# Altium schematic sheet P-MT3620RDB-1-6_WiFi.SchDoc: MT3620 RDB WiFi
size A3; CompanyName: Microsoft Research; DrawnBy: Stuart Taylor; Revision: 1.6; SheetNumber: 1; SheetTotal: 5; ProjectName: MT3620 Reference Development Board
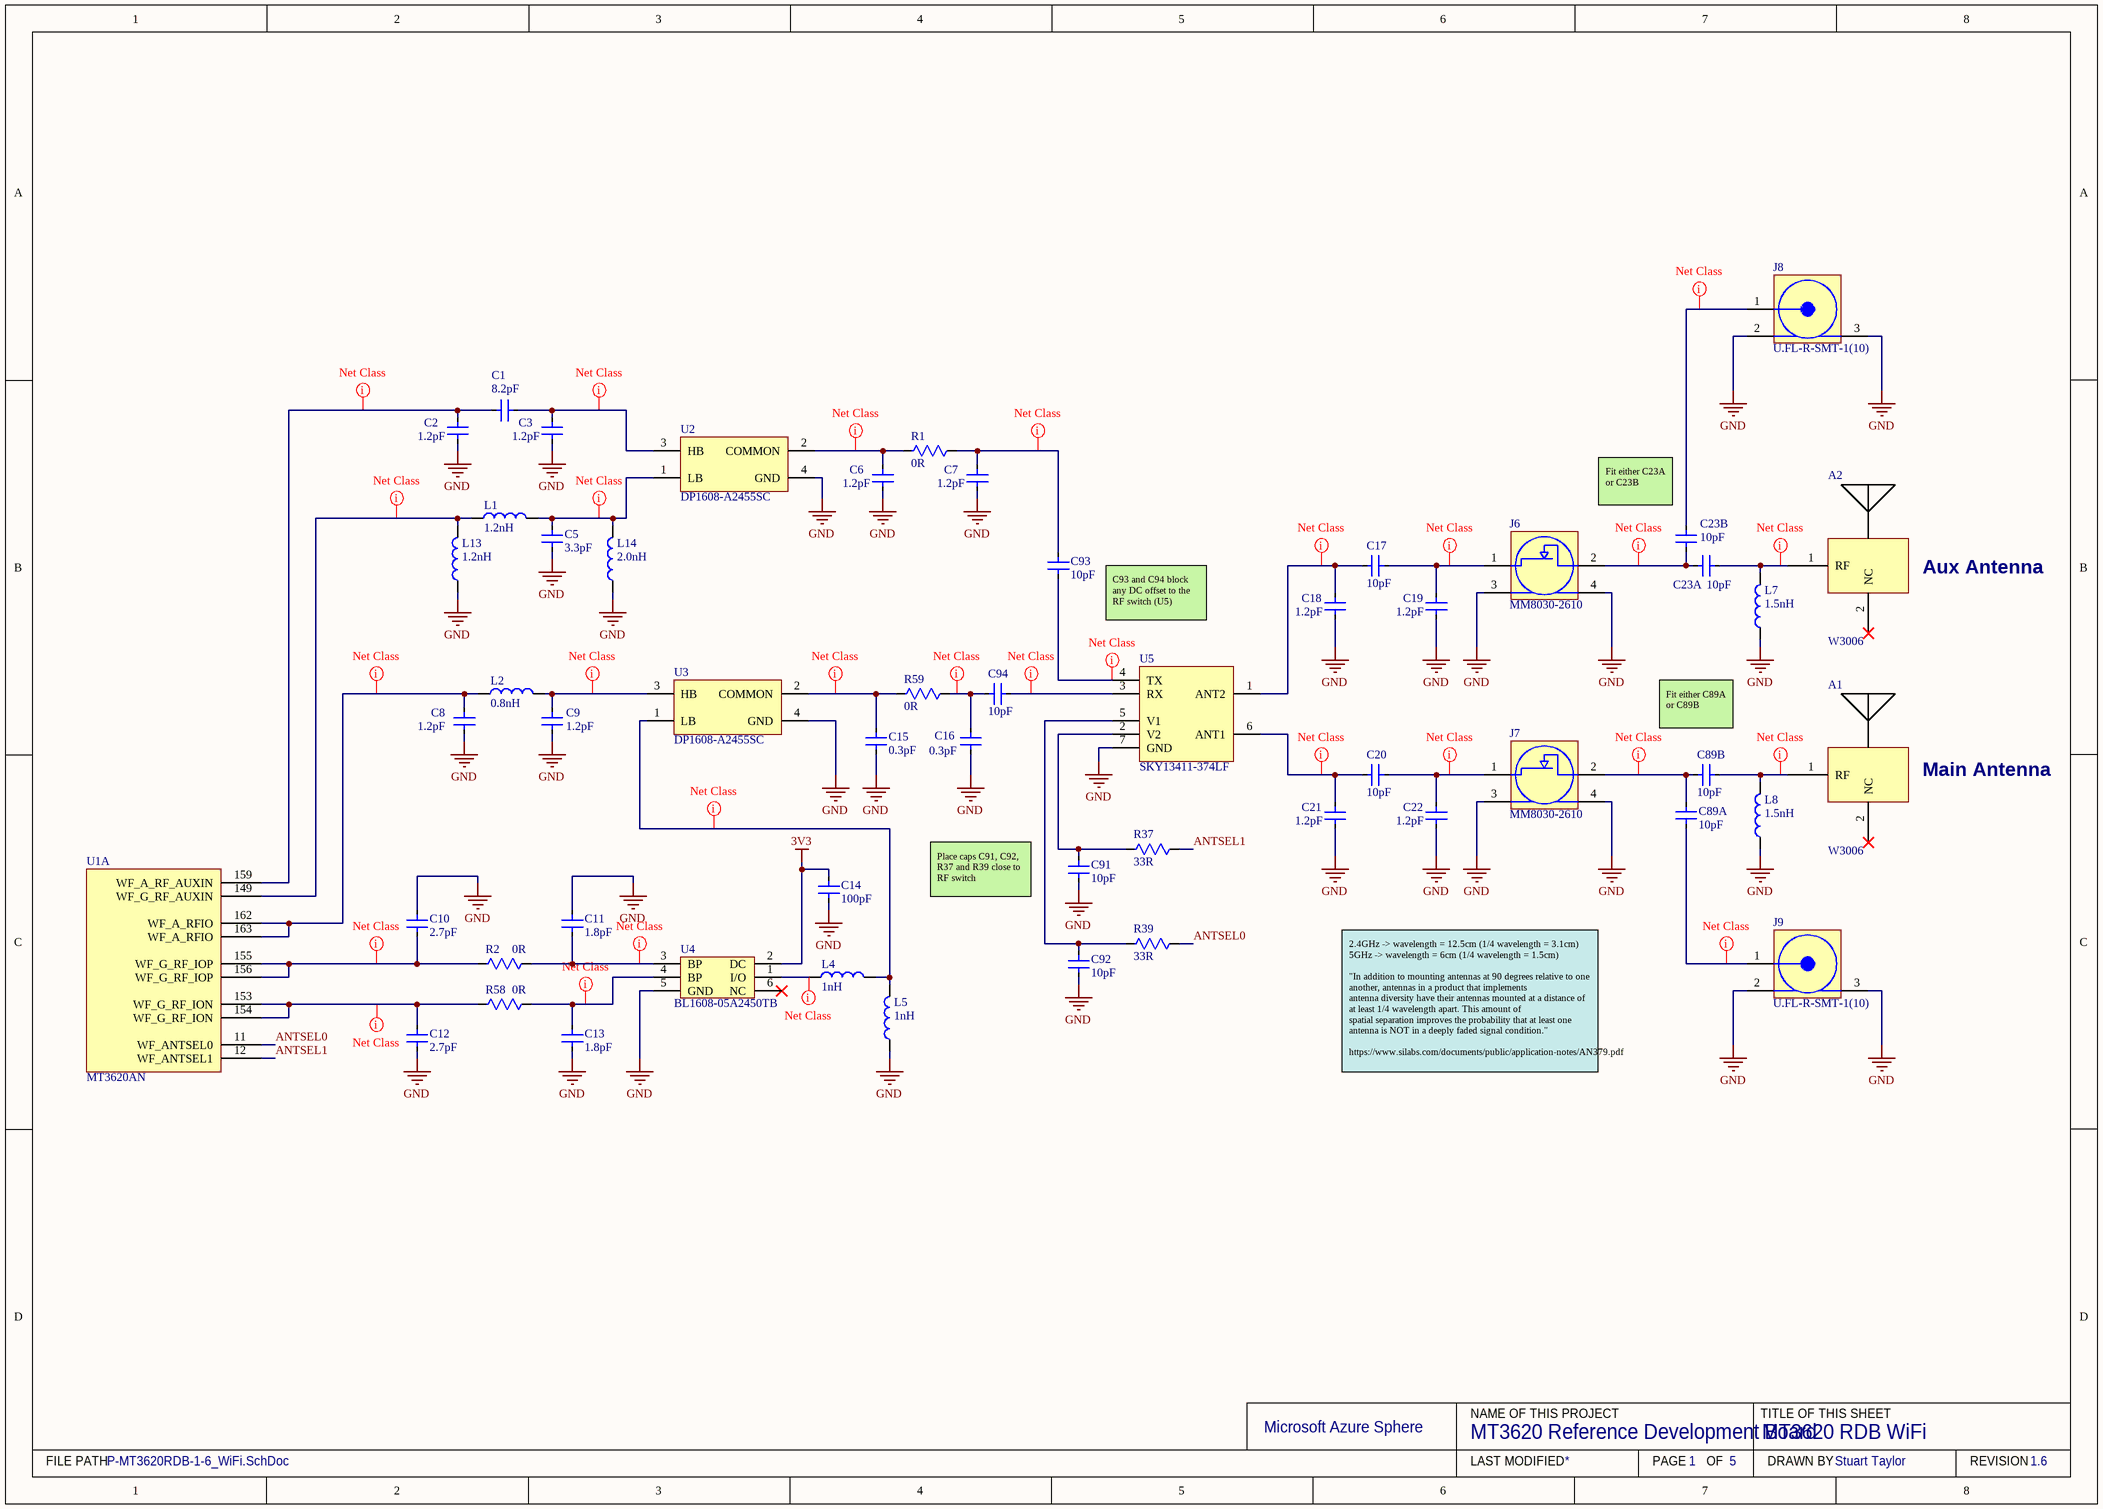
[diagram p0: P-MT3620RDB-1-6_WiFi.SchDoc]

## Parts
A1  W3006  [W3006]
A2  W3006  [W3006]
C1  8.2pF  [TDK 2010]
C2  1.2pF  [TDK 2010]
C3  1.2pF  [TDK 2010]
C5  3.3pF  [TDK 2010]
C6  1.2pF  [TDK 2010]
C7  1.2pF  [TDK 2010]
C8  1.2pF  [TDK 2010]
C9  1.2pF  [TDK 2010]
C10  2.7pF  [TDK 2010]
C11  1.8pF  [TDK 2010]
C12  2.7pF  [TDK 2010]
C13  1.8pF  [TDK 2010]
C14  100pF  [CAPC1005-EIA0402 0.55MM MED]
C15  0.3pF  [TDK 2010]
C16  0.3pF  [TDK 2010]
C17  10pF  [TDK 2010]
C18  1.2pF  [TDK 2010]
C19  1.2pF  [TDK 2010]
C20  10pF  [TDK 2010]
C21  1.2pF  [TDK 2010]
C22  1.2pF  [TDK 2010]
C23  10pF  [CAPC1005-EIA0402 0.55MM MED - THREE WAY]  (parts A,B of 2)
C89  10pF  [CAPC1005-EIA0402 0.55MM MED - THREE WAY]  (parts A,B of 2)
C91  10pF  [TDK 2010]
C92  10pF  [TDK 2010]
C93  10pF  [TDK 2010]
C94  10pF  [TDK 2010]
J6  MM8030-2610  [MM8030-2610]
J7  MM8030-2610  [MM8030-2610]
J8  U.FL-R-SMT-1(10)  [U.FL-R-SMT-1(10)]
J9  U.FL-R-SMT-1(10)  [U.FL-R-SMT-1(10)]
L1  1.2nH  [TDK 2010]
L2  0.8nH  [TDK 2010]
L4  1nH  [TDK 2010]
L5  1nH  [TDK 2010]
L7  1.5nH  [TDK 2010]
L8  1.5nH  [TDK 2010]
L13  1.2nH  [TDK 2010]
L14  2.0nH  [TDK 2010]
R1  0R  [TDK 2010]
R2  0R  [TDK 2010]
R37  33R  [RES 0402 MEDIUM DENSITY]
R39  33R  [RES 0402 MEDIUM DENSITY]
R58  0R  [TDK 2010]
R59  0R  [TDK 2010]
U1  MT3620AN  [MT3620_MaskSquaresVias50]  (part A of 14)
U2  DP1608-A2455SC  [DP1608-A2455SC]
U3  DP1608-A2455SC  [DP1608-A2455SC]
U4  BL1608-05A2450TB  [BL1608-05A2450TB]
U5  SKY13411-374LF  [SKY13411-374LF]

## Nets
3V3: C14.2 U4.2(DC)
GND: C2.1 C3.1 C5.1 C6.1 C7.1 C8.1 C9.1 C10.2 C11.2 C12.1 C13.1 C14.1 C15.1 C16.1 C18.1 C19.1 C21.1 C22.1 C91.1 C92.1 J6.3(GND) J6.4(GND) J7.3(GND) J7.4(GND) J8.2(GND) J8.3(GND) J9.2(GND) J9.3(GND) L5.1 L7.1 L8.1 L13.1 L14.1 U2.4(GND) U3.4(GND) U4.5(GND) U5.7(GND)
ANTSEL0: R39.1 U1.11(WF_ANTSEL0)
ANTSEL1: R37.1 U1.12(WF_ANTSEL1)
NetA1_1: A1.1(RF) C89.3 L8.2
NetA2_1: A2.1(RF) C23.2 L7.2
NetC1_1: C1.1 C2.2 U1.159(WF_A_RF_AUXIN)
NetC1_2: C1.2 C3.2 U2.3(HB)
NetC5_2: C5.2 L1.2 L14.2 U2.1(LB)
NetC6_2: C6.2 R1.2 U2.2(COMMON)
NetC7_2: C7.2 C93.2 R1.1
NetC8_2: C8.2 L2.1 U1.162(WF_A_RFIO) U1.163(WF_A_RFIO)
NetC9_2: C9.2 L2.2 U3.3(HB)
NetC10_1: C10.1 R2.2 U1.155(WF_G_RF_IOP) U1.156(WF_G_RF_IOP)
NetC11_1: C11.1 R2.1 U4.3(BP)
NetC12_2: C12.2 R58.2 U1.153(WF_G_RF_ION) U1.154(WF_G_RF_ION)
NetC13_2: C13.2 R58.1 U4.4(BP)
NetC15_2: C15.2 R59.2 U3.2(COMMON)
NetC16_2: C16.2 C94.2 R59.1
NetC17_1: C17.1 C18.2 U5.1(ANT2)
NetC17_2: C17.2 C19.2 J6.1(IN)
NetC20_1: C20.1 C21.2 U5.6(ANT1)
NetC20_2: C20.2 C22.2 J7.1(IN)
NetC23_1: C23.1 J6.2(OUT)
NetC23_3: C23.3 J8.1(IN)
NetC89_1: C89.1 J7.2(OUT)
NetC89_2: C89.2 J9.1(IN)
NetC91_2: C91.2 R37.2 U5.2(V2)
NetC92_2: C92.2 R39.2 U5.5(V1)
NetC93_1: C93.1 U5.4(TX)
NetC94_1: C94.1 U5.3(RX)
NetL1_1: L1.1 L13.2 U1.149(WF_G_RF_AUXIN)
NetL4_1: L4.1 U4.1(I/O)
NetL4_2: L4.2 L5.2 U3.1(LB)

Not connected (* = marked no-connect by the designer): A1 2(NC)*; A2 2(NC)*; U4 6(NC)*

## Layout directives
net class RF: NetA1_1, NetA2_1, NetC1_1, NetC1_2, NetC5_2, NetC6_2, NetC7_2, NetC8_2, NetC9_2, NetC15_2, NetC16_2, NetC17_1, NetC17_2, NetC20_1, NetC20_2, NetC23_1, NetC23_3, NetC89_1, NetC89_2, NetC93_1, NetC94_1, NetL1_1, NetL4_1, NetL4_2
net class RFD: NetC10_1, NetC11_1, NetC12_2, NetC13_2

## Notes on the sheet
- (near C23) Fit either C23A or C23B
- Aux Antenna
- C93 and C94 block any DC offset to the RF switch (U5)
- Fit either C89A or C89B
- Main Antenna
- (near C91) Place caps C91, C92, R37 and R39 close to RF switch
- 2.4GHz -> wavelength = 12.5cm (1/4 wavelength = 3.1cm)
  5GHz -> wavelength = 6cm (1/4 wavelength = 1.5cm)
  "In addition to mounting antennas at 90 degrees relative to one another, antennas in a product that implements
  antenna diversity have their antennas mounted at a distance of at least 1/4 wavelength apart. This amount of
  spatial separation improves the probability that at least one antenna is NOT in a deeply faded signal condition."
  https://www.silabs.com/documents/public/application-notes/AN379.pdf
- Microsoft Azure Sphere
- NAME OF THIS PROJECT
- TITLE OF THIS SHEET
- FILE PATH
- LAST MODIFIED
- PAGE
- OF
- DRAWN BY
- REVISION

## Library data of the parts
A1 A2 = W3006: W3006 Chip Antenna; Manufacturer: Pulse Electronics Corporation; Frequency Group: UHF (2 GHz ~ 3 GHz), SHF (f > 4 GHz); Frequency (Center/Band): 2.4GHz, 5.5GHz; Frequency Range: 2.4GHz ~ 2.483GHz, 5.15GHz ~ 5.85GHz; Number of Bands: 2; Return Loss: -8dB, -10dB; Gain: 3.2dBi, 4.2dBi; NoThermalRelief: ture; Supplier 1: Digi-Key; Supplier Part Number 1: 553-1673-2-ND; Manufacturer Part Number: W3006; RoHS: RoHS Compliant; Category: RF/IF and RFID; Stock 1: 2000; Pricing 1: 1000=0.72505, 2000=0.67505, 5000=0.65004, 10000=0.62504 (GBP); Packaging: Tape & Reel (TR); Part Status: Active; Antenna Type: Chip; VSWR: -; Power - Max: -; Features: -; Termination: Solder; Ingress Protection: -; Mounting Type: Surface Mount; Height (Max): 0.059" (1.50mm); Applications: WLAN, Zigbee™; ComponentLink1URL: http://productfinder.pulseeng.com/products/datasheets/W3006.pdf; ComponentLink1Description: http://productfinder.pulseeng.com/products/datasheets/W3006.pdf
C1 = GJM0335C1E8R2CB01D: CAP CER 8.2PF 25V NP0 0201; Manufacturer: Murata; Dielectric: C0G; Supplier 1: Digi-Key; Manufacturer Part Number: GJM0335C1E8R2CB01D; Stock 1: 3138; Pricing 1: 1=0.1, 10=0.043, 100=0.0192, 500=0.0137, 1000=0.0108, 2500=0.0098, 5000=0.009 (USD); Mount: Surface Mount; Case/Package: 0201; Weight: 1.2E-05oz; Case Code (Imperial): 0201; Case Code (Metric): 0603; Min Operating Temperature: -55°C; Max Operating Temperature: 125°C; Capacitance: 8.2pF; Voltage Rating (DC): 25V; Packaging: Tape and Reel; Voltage Rating: 25V; Termination: SMD/SMT; Package Quantity: 15000; Length: 0.024inch; Height: 0.3mm; Width: 0.3mm; Thickness: 0.013inch; ComponentLink1URL: http://www.mouser.com/ds/2/281/Murata GJM Series-1186094.pdf; ComponentLink1Description: http://www.mouser.com/ds/2/281/Murata GJM Series-1186094.pdf; Supplier Part Number 1: 490-14540-1-ND
C2 C3 C6-C9 C18 C19 C21 C22 = 1.2pF 0201 25V: CAP CER 1.2PF 25V C0G 0201; Manufacturer: TDK Corporation; Manufacturer Part Number: C0603C0G1E1R2B; Tolerance: ±0.1pF; Temperature Coefficient: C0G, NP0; NoThermalRelief: true; Supplier 1: Digi-Key; RoHS: RoHS Compliant; Category: Capacitors; Stock 1: 891; Pricing 1: 1=0.07, 10=0.022, 100=0.0101, 250=0.00828, 500=0.00708, 1000=0.00552, 5000=0.0046 (GBP); Packaging: Cut Tape (CT); Capacitance: 1.2pF; Voltage - Rated: 25V; Mounting Type: Surface Mount, MLCC; Operating Temperature: -55°C ~ 125°C; Applications: General Purpose; Ratings: -; Package / Case: 0201 (0603 Metric); Size / Dimension: 0.024" L x 0.012" W (0.60mm x 0.30mm); Height - Seated (Max): -; Thickness (Max): 0.013" (0.33mm); Lead Spacing: -; Features: -; Lead Style: -; ComponentLink1URL: http://media.digikey.com/pdf/Data%20Sheets/TDK%20PDFs/C_Series_GeneralAppl_B11.pdf; ComponentLink1Description: http://media.digikey.com/pdf/Data%20Sheets/TDK%20PDFs/C_Series_GeneralAppl_B11.pdf; Supplier Part Number 1: 445-4594-1-ND
C5 = 3.3pF 0201 25V: Cap Ceramic 3.3pF 25V C0G 0.25pF SMD 0201 125C T/R; Manufacturer: TDK; Manufacturer Part Number: CGA1A2C0G1E3R3C030BA; NoThermalRelief: true; Supplier 1: Digi-Key; Stock 1: 1636; Pricing 1: 1=0.12, 10=0.088, 100=0.0413, 500=0.029, 1000=0.024, 2500=0.0223, 5000=0.0204 (USD); Mount: Surface Mount; Case/Package: 0201; Weight: 6E-06oz; Case Code (Metric): 0603; Case Code (Imperial): 0201; Min Operating Temperature: -55°C; Max Operating Temperature: 125°C; Packaging: Tape and Reel; Package Quantity: 1; Capacitance: 3.3pF; Voltage Rating: 25V; Voltage Rating (DC): 25V; Dielectric: C0G; Termination: SMD/SMT; Composition: Ceramic; Length: 0.6mm; Height: 0.3mm; Width: 0.012inch; Thickness: 0.013inch; Depth: 0.3mm; ComponentLink1URL: https://datasheet.ciiva.com/24220/cga1a2c0g1e3r3c030ba-272998-24220339.pdf; ComponentLink1Description: https://datasheet.ciiva.com/24220/cga1a2c0g1e3r3c030ba-272998-24220339.pdf; Supplier Part Number 1: 445-9045-6-ND
C10 C12 = 2.7pF 0201 25V: CAP CER 2.7PF 25V C0G 0201; Manufacturer: TDK; Manufacturer Part Number: C0603C0G1E2R7B; Catalog Drawings: C SERIES_0201; Tolerance: ±0.1pF; Temperature Coefficient: C0G, NP0; Kits: SAMPLE KIT 1009-ND  - KIT CAP CER RF .2PF-10PF 445-9011-KIT-ND  - KIT CAP CER RF .2PF-10PF SMD; Other Names: 445-4610-1; NoThermalRelief: true; Supplier 1: Digikey; Stock 1: 16566; Pricing 1: 1=0.1, 10=0.038, 100=0.0168, 500=0.012, 1000=0.0094, 2500=0.0086, 5000=0.0079 (USD); Standard Package: 1; Category: Capacitors; Family: Ceramic Capacitors; Series: C; Packaging: Cut Tape (CT); Capacitance: 2.7pF; Voltage - Rated: 25V; Mounting Type: Surface Mount, MLCC; Operating Temperature: -55°C ~ 125°C; Applications: General Purpose; Ratings: -; Package / Case: 0201 (0603 Metric); Size / Dimension: 0.024" L x 0.012" W (0.60mm x 0.30mm); Height - Seated (Max): -; Thickness (Max): 0.013" (0.33mm); Lead Spacing: -; Features: -; Lead Style: -; ComponentLink1URL: https://datasheet.ciiva.com/26869/getdatasheetpartid-496273-26869685.pdf; ComponentLink1Description: https://datasheet.ciiva.com/26869/getdatasheetpartid-496273-26869685.pdf; ComponentLink2URL: https://datasheet.ciiva.com/5410/general-b11-5410742.pdf; ComponentLink2Description: https://datasheet.ciiva.com/5410/general-b11-5410742.pdf; ComponentLink3URL: https://datasheet.ciiva.com/130/c-series-generalappl-b11-130943.pdf; ComponentLink3Description: https://datasheet.ciiva.com/130/c-series-generalappl-b11-130943.pdf; ComponentLink4URL: https://datasheet.ciiva.com/130/c-series-generalappl-b11-130945.pdf; ComponentLink4Description: https://datasheet.ciiva.com/130/c-series-generalappl-b11-130945.pdf; ComponentLink5URL: https://datasheet.ciiva.com/130/c-series-generalappl-b11-130944.pdf; ComponentLink5Description: https://datasheet.ciiva.com/130/c-series-generalappl-b11-130944.pdf; Supplier Part Number 1: 445-4610-1-ND
C11 C13 = GJM0335C1E1R8CB01D: CAP CER 1.8PF 25V NP0 0201; Manufacturer: Murata; Dielectric: C0G; Supplier 1: Digi-Key; Manufacturer Part Number: GJM0335C1E1R8CB01D; Stock 1: 87034; Pricing 1: 1=0.1, 10=0.043, 100=0.0192, 500=0.0137, 1000=0.0108, 2500=0.0098, 5000=0.009 (USD); Mount: Surface Mount; Case/Package: 0201; Case Code (Imperial): 0201; Case Code (Metric): 0603; Min Operating Temperature: -55°C; Max Operating Temperature: 125°C; Capacitance: 1.8pF; Package Quantity: 1; Packaging: Tape and Reel; Voltage Rating: 25V; Termination: SMD/SMT; Voltage Rating (DC): 25V; Length: 0.6mm; Height: 0.3mm; Width: 0.012inch; Thickness: 0.013inch; Depth: 0.3mm; Radiation Hardening: No; Lead Free: Lead Free; ComponentLink1URL: https://datasheet.ciiva.com/11615/product-11615586.pdf; ComponentLink1Description: https://datasheet.ciiva.com/11615/product-11615586.pdf; ComponentLink2URL: https://datasheet.ciiva.com/133/partnumbering-e-01-133454.pdf; ComponentLink2Description: https://datasheet.ciiva.com/133/partnumbering-e-01-133454.pdf; ComponentLink3URL: https://datasheet.ciiva.com/133/partnumbering-e-01-133455.pdf; ComponentLink3Description: https://datasheet.ciiva.com/133/partnumbering-e-01-133455.pdf; ComponentLink4URL: https://datasheet.ciiva.com/17453/product-17453450.pdf; ComponentLink4Description: https://datasheet.ciiva.com/17453/product-17453450.pdf; ComponentLink5URL: https://datasheet.ciiva.com/133/partnumbering-e-01-133453.pdf; ComponentLink5Description: https://datasheet.ciiva.com/133/partnumbering-e-01-133453.pdf; Supplier Part Number 1: 490-3059-1-ND
C14 = 100pF 0402 C0G, NP0 50V: CAP CER 100PF 50V 5% NP0 0402; Manufacturer: TDK Corporation; Manufacturer Part Number: C1005C0G1H101J050BA; NoThermalRelief: true; Supplier 1: Digi-Key; RoHS: RoHS Compliant; Category: Capacitors; Stock 1: 47833; Pricing 1: 0.00233; Packaging: Tape & Reel (TR); Tolerance: ±5%; Voltage - Rated: 50V; Temperature Coefficient: C0G, NP0; Mounting Type: Surface Mount, MLCC; Operating Temperature: -55°C ~ 125°C; Applications: General Purpose; Package / Case: 0402 (1005 Metric); Size / Dimension: 0.039" L x 0.020" W (1.00mm x 0.50mm); Height - Seated (Max): -; Thickness (Max): 0.022" (0.55mm); Lead Spacing: -; Features: -; Lead Style: -; ComponentLink1URL: http://product.tdk.com/en/catalog/datasheets/mlcc_commercial_general_en.pdf; ComponentLink1Description: http://product.tdk.com/en/catalog/datasheets/mlcc_commercial_general_en.pdf; Supplier Part Number 1: 445-1247-2-ND; Ratings: -; Capacitance: 100pF
C15 C16 = 0.3pF 0201 25V: CAP CER 0.3PF 25V C0G 0201; Manufacturer: TDK Corporation; Manufacturer Part Number: C0603C0G1E0R3B; Capacitance: 0.30pF; Tolerance: ±0.1pF; Temperature Coefficient: C0G, NP0; NoThermalRelief: true; Supplier 1: Digi-Key; RoHS: RoHS Compliant; Category: Capacitors; Stock 1: 19260; Pricing 1: 1=0.07, 10=0.03, 100=0.0139, 250=0.01132, 500=0.0097, 1000=0.00756, 5000=0.0063 (GBP); Packaging: Cut Tape (CT); Voltage - Rated: 25V; Mounting Type: Surface Mount, MLCC; Operating Temperature: -55°C ~ 125°C; Applications: General Purpose; Ratings: -; Package / Case: 0201 (0603 Metric); Size / Dimension: 0.024" L x 0.012" W (0.60mm x 0.30mm); Height - Seated (Max): -; Thickness (Max): 0.013" (0.33mm); Lead Spacing: -; Features: -; Lead Style: -; ComponentLink1URL: http://media.digikey.com/pdf/Data%20Sheets/TDK%20PDFs/C_Series_GeneralAppl_B11.pdf; ComponentLink1Description: http://media.digikey.com/pdf/Data%20Sheets/TDK%20PDFs/C_Series_GeneralAppl_B11.pdf; Supplier Part Number 1: 445-7205-1-ND
C17 C20 C91-C94 = 10pF 0201 25V: CAP CER 10PF 25V C0G 0201; Manufacturer: TDK Corporation; Manufacturer Part Number: C0603C0G1E100D030BA; Tolerance: ±0.5pF; Temperature Coefficient: C0G, NP0; NoThermalRelief: true; Supplier 1: Digi-Key; RoHS: RoHS Compliant; Category: Capacitors; Stock 1: 331754; Pricing 1: 1=0.07, 10=0.03, 100=0.0139, 250=0.01132, 500=0.0097, 1000=0.00756, 5000=0.0063 (GBP); Packaging: Digi-Reel®; Capacitance: 10pF; Voltage - Rated: 25V; Mounting Type: Surface Mount, MLCC; Operating Temperature: -55°C ~ 125°C; Applications: General Purpose; Ratings: -; Package / Case: 0201 (0603 Metric); Size / Dimension: 0.024" L x 0.012" W (0.60mm x 0.30mm); Height - Seated (Max): -; Thickness (Max): 0.013" (0.33mm); Lead Spacing: -; Features: Low ESL; Lead Style: -; ComponentLink1URL: https://product.tdk.com/info/en/catalog/datasheets/mlcc_commercial_general_en.pdf; ComponentLink1Description: https://product.tdk.com/info/en/catalog/datasheets/mlcc_commercial_general_en.pdf; Supplier Part Number 1: 445-4651-6-ND
C23 C89 = 10pF 0402 C0G, NP0 50V_1: CAP CER 10PF 50V NP0 0402 - Three-way pads; Manufacturer: TDK Corporation; Manufacturer Part Number: C1005C0G1H100D050BA; Tolerance: ±0.5pF; NoThermalRelief: true; Supplier 1: Digi-Key; RoHS: RoHS Compliant; Category: Capacitors; Stock 1: 47833; Pricing 1: 0.00274; Packaging: Tape & Reel (TR); Voltage - Rated: 50V; Temperature Coefficient: C0G, NP0; Mounting Type: Surface Mount, MLCC; Operating Temperature: -55°C ~ 125°C; Applications: General Purpose; Package / Case: 0402 (1005 Metric); Size / Dimension: 0.039" L x 0.020" W (1.00mm x 0.50mm); Height - Seated (Max): -; Thickness (Max): 0.022" (0.55mm); Lead Spacing: -; Features: -; Lead Style: -; ComponentLink1URL: http://product.tdk.com/en/catalog/datasheets/mlcc_commercial_general_en.pdf; ComponentLink1Description: http://product.tdk.com/en/catalog/datasheets/mlcc_commercial_general_en.pdf; Supplier Part Number 1: 445-1235-2-ND; Ratings: -; Capacitance: 10pF
J6 J7 = MM8030-2610: CONN UMC RECEPT SMD 2x2mm; Manufacturer: Murata Electronics North America; Manufacturer Part Number: MM8030-2610RK0; Connector Style: Ultra Miniature Coaxial; Connector Type: Receptacle, Female Socket; Contact Termination: Solder; Impedance: 50 Ohm; Frequency - Max: 11GHz; Center Contact Plating: Gold; Voltage Rating: 30V; NoThermalRelief: true; Supplier 1: Digi-Key; RoHS: RoHS Compliant; Category: Connectors, Interconnects; Stock 1: 11893; Pricing 1: 1=0.34, 10=0.325, 25=0.2788, 50=0.2368, 100=0.2276, 250=0.2044, 500=0.1951, 1000=0.16258, 2500=0.14864 (GBP); Packaging: Cut Tape (CT); Shield Termination: Solder; Mounting Type: Surface Mount; Cable Group: -; Fastening Type: Snap-On; Features: Internal Switch; Housing Color: -; Ingress Protection: -; Body Material: -; Body Finish: -; Center Contact Material: -; Dielectric Material: -; Operating Temperature: -40°C ~ 85°C; ComponentLink1URL: http://www.murata.com/~/media/webrenewal/support/library/catalog/products/switch/switch/o33e.ashx; ComponentLink1Description: http://www.murata.com/~/media/webrenewal/support/library/catalog/products/switch/switch/o33e.ashx; Supplier Part Number 1: 490-11804-1-ND
J8 J9 = U.FL-R-SMT-1(10): CONN UMC JACK STR 50 OHM SMD; Manufacturer: Hirose Electric (HRS); Featured Product: U.FL Series Connectors; Connector Style: U.FL, Ultra Miniature Coaxial; Connector Type: Receptacle, Male Pin; Contact Termination: Solder; Impedance: 50 Ohm; Frequency - Max: 6GHz; Body Material: Phosphor Bronze; Body Finish: Silver; Center Contact Material: Brass; Center Contact Plating: Gold; Dielectric Material: Liquid Crystal Polymer (LCP); Online Catalog: UMCC (Ultra Miniature Coax Connectors), U.FL Series; Other Names: H11891TR  Q5400621  U.FL-R-SMT-1 10  U.FL-R-SMT-1(10)-ND  UFLRSMT110; NoThermalRelief: true; Supplier 1: Farnell; Manufacturer Part Number: U.FL-R-SMT-1(10); Stock 1: 11130; Pricing 1: 1=0.84, 10=0.77 (GBP); Standard Package: 2,500; Category: Connectors, Interconnects; Family: Coaxial Connectors (RF); Series: U.FL; Packaging: Tape & Reel (TR); Shield Termination: Solder; Mounting Type: Surface Mount; Cable Group: -; Fastening Type: Snap-On; Features: -; Housing Color: Beige; Ingress Protection: -; Voltage Rating: -; Operating Temperature: -40°C ~ 90°C; ComponentLink1URL: https://datasheet.ciiva.com/11762/0900766b8105243f-11762474.pdf; ComponentLink1Description: https://datasheet.ciiva.com/11762/0900766b8105243f-11762474.pdf; ComponentLink2URL: https://datasheet.ciiva.com/7651/91524-7651915.pdf; ComponentLink2Description: https://datasheet.ciiva.com/7651/91524-7651915.pdf; ComponentLink3URL: https://datasheet.ciiva.com/7651/91524-7651914.pdf; ComponentLink3Description: https://datasheet.ciiva.com/7651/91524-7651914.pdf; Supplier Part Number 1: 1688077RL
L1 L13 = 1.2nH 0201: FIXED IND 1.2NH 1A 80 MOHM SMD; Manufacturer: TDK; Manufacturer Part Number: MHQ0603P1N2CT000; Core Material: Non-Magnetic; Shielding: Unshielded; DC Resistance (DCR): 80mR; Self Resonant Frequency: 10GHz; Test Frequency: 500MHz; NoThermalRelief: true; Supplier 1: Digi-Key; Stock 1: 13400; Pricing 1: 1=0.51, 10=0.443, 100=0.3163, 500=0.2657, 1000=0.2151, 2500=0.2024 (USD); Mount: Surface Mount; Case/Package: 0201; Case Code (Metric): 0603; Case Code (Imperial): 0201; Min Operating Temperature: -55°C; Max Operating Temperature: 125°C; Package Quantity: 15000; Packaging: Tape and Reel; Current Rating: 1A; Inductance: 1.2nh; Length: 0.026inch; Width: 0.014inch; Height - Seated (Max): 0.016inch; ComponentLink1URL: http://product.tdk.com/inductor/ind/en/documents/inductor_commercial_high-frequency_mhq_en.pdf; ComponentLink1Description: http://product.tdk.com/inductor/ind/en/documents/inductor_commercial_high-frequency_mhq_en.pdf; Supplier Part Number 1: 445-16782-6-ND
L2 = 0.8nH 0201: FIXED IND 0.8NH 1A 70 MOHM SMD; Manufacturer: TDK Corporation; Manufacturer Part Number: MHQ0603P0N8CT000; Type: Multilayer; Material - Core: Non-Magnetic; Tolerance: ±0.2nH; Shielding: Unshielded; DC Resistance (DCR): 70 mOhm Max; Frequency - Self Resonant: 10GHz; Frequency - Test: 500MHz; Supplier 1: Digi-Key; RoHS: RoHS Compliant; Category: Inductors, Coils, Chokes; Stock 1: 28900; Pricing 1: 1=0.31, 10=0.272, 50=0.2214, 100=0.2043, 500=0.17708, 1000=0.14984 (GBP); Packaging: Cut Tape (CT); Inductance: 0.8nH; Current Rating: 1A; Current - Saturation: -; Q @ Freq: -; Ratings: -; Operating Temperature: -55°C ~ 125°C; Mounting Type: Surface Mount; Package / Case: 0201 (0603 Metric); Size / Dimension: 0.026" L x 0.014" W (0.65mm x 0.35mm); Height - Seated (Max): 0.016" (0.40mm); ComponentLink1URL: https://product.tdk.com/info/en/catalog/datasheets/inductor_commercial_high-frequency_mhq0603p_en.pdf; ComponentLink1Description: https://product.tdk.com/info/en/catalog/datasheets/inductor_commercial_high-frequency_mhq0603p_en.pdf; Supplier Part Number 1: 445-16758-1-ND
L4 L5 = 1nH 0201: FIXED IND 1NH 1A 70 MOHM SMD; Manufacturer: TDK Corporation; Manufacturer Part Number: MHQ0603P1N0CT000; Type: Multilayer; Material - Core: Non-Magnetic; Tolerance: ±0.2nH; Shielding: Unshielded; DC Resistance (DCR): 70 mOhm Max; Frequency - Self Resonant: 10GHz; Frequency - Test: 500MHz; NoThermalRelief: true; Supplier 1: Digi-Key; RoHS: RoHS Compliant; Category: Inductors, Coils, Chokes; Stock 1: 28900; Pricing 1: 1=0.34, 10=0.3, 50=0.2436, 100=0.2248, 500=0.1948, 1000=0.16483 (GBP); Packaging: Cut Tape (CT); Inductance: 1nH; Current Rating: 1A; Current - Saturation: -; Q @ Freq: -; Ratings: -; Operating Temperature: -55°C ~ 125°C; Mounting Type: Surface Mount; Package / Case: 0201 (0603 Metric); Size / Dimension: 0.026" L x 0.014" W (0.65mm x 0.35mm); Height - Seated (Max): 0.016" (0.40mm); ComponentLink1URL: https://product.tdk.com/info/en/catalog/datasheets/inductor_commercial_high-frequency_mhq0603p_en.pdf; ComponentLink1Description: https://product.tdk.com/info/en/catalog/datasheets/inductor_commercial_high-frequency_mhq0603p_en.pdf; Supplier Part Number 1: 445-16776-1-ND
L7 L8 = LQP03TN1N5B02D: MURATA - LQP03TN1N5B02D - INDUCTOR, 1.5NH, 0.6A, 0.1NH, 15GHZ; Product Range: LQP03; Inductance: 1.5; DC Current Rating: 600; High Frequency Inductor Case: 0201 [0603 Metric]; Inductor Construction: Thin Film; DC Resistance Max: 0.15; Inductance Tolerance: ± 0.1; Self Resonant Frequency Min: 15; SVHC: No SVHC (17-Dec-2015; NoThermalRelief: true; Supplier 1: Farnell; Manufacturer: MURATA; Manufacturer Part Number: LQP03TN1N5B02D; RoHS: YES; Stock 1: 2224; Pricing 1: 10=0.0488, 100=0.037, 500=0.0284, 2500=0.023, 7500=0.021, 15000=0.0179, 75000=0.0163, 150000=0.016 (GBP); Packaging: Cut Tape; ComponentLink1URL: http://www.farnell.com/datasheets/1888754.pdf; ComponentLink1Description: http://www.farnell.com/datasheets/1888754.pdf; Supplier Part Number 1: 2470348RL
L14 = 2.0nH 0201: FIXED IND 2NH 700MA 120 MOHM SMD; Manufacturer: TDK; Manufacturer Part Number: MHQ0603P2N0CT000; Core Material: Non-Magnetic; Shielding: Unshielded; DC Resistance (DCR): 120mR; Self Resonant Frequency: 10GHz; Test Frequency: 500MHz; NoThermalRelief: true; Supplier 1: Digi-Key; Stock 1: 13400; Pricing 1: 1=0.51, 10=0.443, 100=0.3163, 500=0.2657, 1000=0.2151, 2500=0.2024 (USD); Mount: Surface Mount; Case/Package: 0201; Case Code (Metric): 0603; Case Code (Imperial): 0201; Min Operating Temperature: -55°C; Max Operating Temperature: 125°C; Package Quantity: 15000; Packaging: Cut Tape; Current Rating: 700mA; Inductance: 2nh; Length: 0.026inch; Width: 0.014inch; Height - Seated (Max): 0.016inch; ComponentLink1URL: https://datasheet.ciiva.com/41830/inductor-commercial-high-frequency-mhq-en-41830309.pdf; ComponentLink1Description: https://datasheet.ciiva.com/41830/inductor-commercial-high-frequency-mhq-en-41830309.pdf; Supplier Part Number 1: 445-16814-1-ND
R1 R2 R58 R59 = 0R 0201: RES SMD 0.0OHM JUMPER 1/20W 0201; Manufacturer: Panasonic Electronic Components; Manufacturer Part Number: ERJ-1GN0R00C; Resistance (Ohms): 0.0; Power (Watts): 0.05W, 1/20W; NoThermalRelief: true; Supplier 1: Digi-Key; RoHS: RoHS Compliant; Category: Resistors; Stock 1: 620507; Pricing 1: 1=0.07, 50=0.0212, 100=0.0161, 250=0.01196, 500=0.00882, 1000=0.00588, 5000=0.00414 (GBP); Packaging: Cut Tape (CT); Tolerance: Jumper; Composition: Thick Film; Features: Automotive AEC-Q200; Temperature Coefficient: -; Operating Temperature: -55°C ~ 125°C; Package / Case: 0201 (0603 Metric); Supplier Device Package: 0201; Size / Dimension: 0.024" L x 0.012" W (0.60mm x 0.30mm); Height: 0.010" (0.26mm); Number of Terminations: 2; ComponentLink1URL: http://industrial.panasonic.com/www-cgi/jvcr13pz.cgi?E+PZ+3+AOA0001+ERJ1GN0R00C+8+WW; ComponentLink1Description: http://industrial.panasonic.com/www-cgi/jvcr13pz.cgi?E+PZ+3+AOA0001+ERJ1GN0R00C+8+WW; Supplier Part Number 1: P15979CT-ND
R37 R39 = 33R: RES 33 OHM 1/10W 1% 0402 SMD; Manufacturer: Panasonic Electronic Components; Manufacturer Part Number: ERJ-2RKF33R0X; Power (Watts): 0.1W, 1/10W; Temperature Coefficient: ±100ppm/°C; Supplier 1: Digi-Key; RoHS: RoHS Compliant; Category: Resistors; Stock 1: 533394; Pricing 1: 1=0.07, 50=0.0128, 100=0.0097, 250=0.0072, 500=0.00532, 1000=0.00355, 5000=0.0025 (GBP); Packaging: Cut Tape (CT); Tolerance: ±1%; Composition: Thick Film; Features: -; Package / Case: 0402 (1005 Metric); Supplier Device Package: 0402; Size / Dimension: 0.039" L x 0.020" W (1.00mm x 0.50mm); Height: 0.016" (0.40mm); Number of Terminations: 2; ComponentLink1URL: http://industrial.panasonic.com/www-cgi/jvcr13pz.cgi?E+PZ+3+AOA0002+ERJ2RKF33R0X+7+WW; ComponentLink1Description: http://industrial.panasonic.com/www-cgi/jvcr13pz.cgi?E+PZ+3+AOA0002+ERJ2RKF33R0X+7+WW; Supplier Part Number 1: P33.0LCT-ND; Resistance (Ohms): 33R
U1 = MT3620AN: Manufacturer 1: MediaTek Inc.; Do Not Substitute: true; Manufacturer Part Number 1: MT3620AN; Supplier Part Number 1: MT3620AN; Supplier 1: MediaTek Inc.
U2 U3 = DP1608-A2455SC: Diplexer; Manufacturer 1: ACX; NoThermalRelief: true; Manufacturer Part Number 1: DP1608-A2455SC; Supplier Part Number 1: DP1608-A2455SC; Mounting Type: Surface Mount; Pricing 1: 1500=0.1 (USD); Do Not Substitute: true
  U2: Supplier: ACX
  U3: Supplier 1: ACX
U4 = BL1608-05A2450TB: Balun; Manufacturer 1: ACX; NoThermalRelief: true; Manufacturer Part Number 1: BL1608-05A2450TB; Supplier 1: ACX; Supplier Part Number 1: BL1608-05A2450TB; Mounting Type: Surface Mount; Pricing 1: 1500=0.1 (USD); Do Not Substitute: true
U5 = SKY13411-374LF: RF SWITCH; Manufacturer: Skyworks Solutions Inc.; Frequency - Lower: 100MHz; Frequency - Upper: 6GHz; Isolation @ Frequency: 14dB @ 6GHz (typ); Insertion Loss @ Frequency: 0.9dB @ 6GHz; IIP3: 50dBm (typ); Topology: Reflective; Circuit: DPDT; P1dB: 30dBm (typ) IP1dB; Impedance: 50 Ohm; RF Type: 802.11a/b/g/n; NoThermalRelief: true; Supplier 1: Digi-Key; Manufacturer Part Number: SKY13411-374LF; RoHS: RoHS Compliant; Category: RF/IF and RFID; Stock 1: 13260; Pricing 1: 1=0.31, 100=0.2478 (GBP); Packaging: Cut Tape (CT); Features: -; Operating Temperature: -40°C ~ 85°C; Voltage - Supply: -; Package / Case: 6-XFDFN Exposed Pad; Supplier Device Package: 6-MLPD (1.5x1.5); ComponentLink1URL: http://www.skyworksinc.com/uploads/documents/201665B.pdf; ComponentLink1Description: http://www.skyworksinc.com/uploads/documents/201665B.pdf; Supplier Part Number 1: 863-1455-1-ND